# EAGLE design esp_dht (EAGLE 8.1.0)
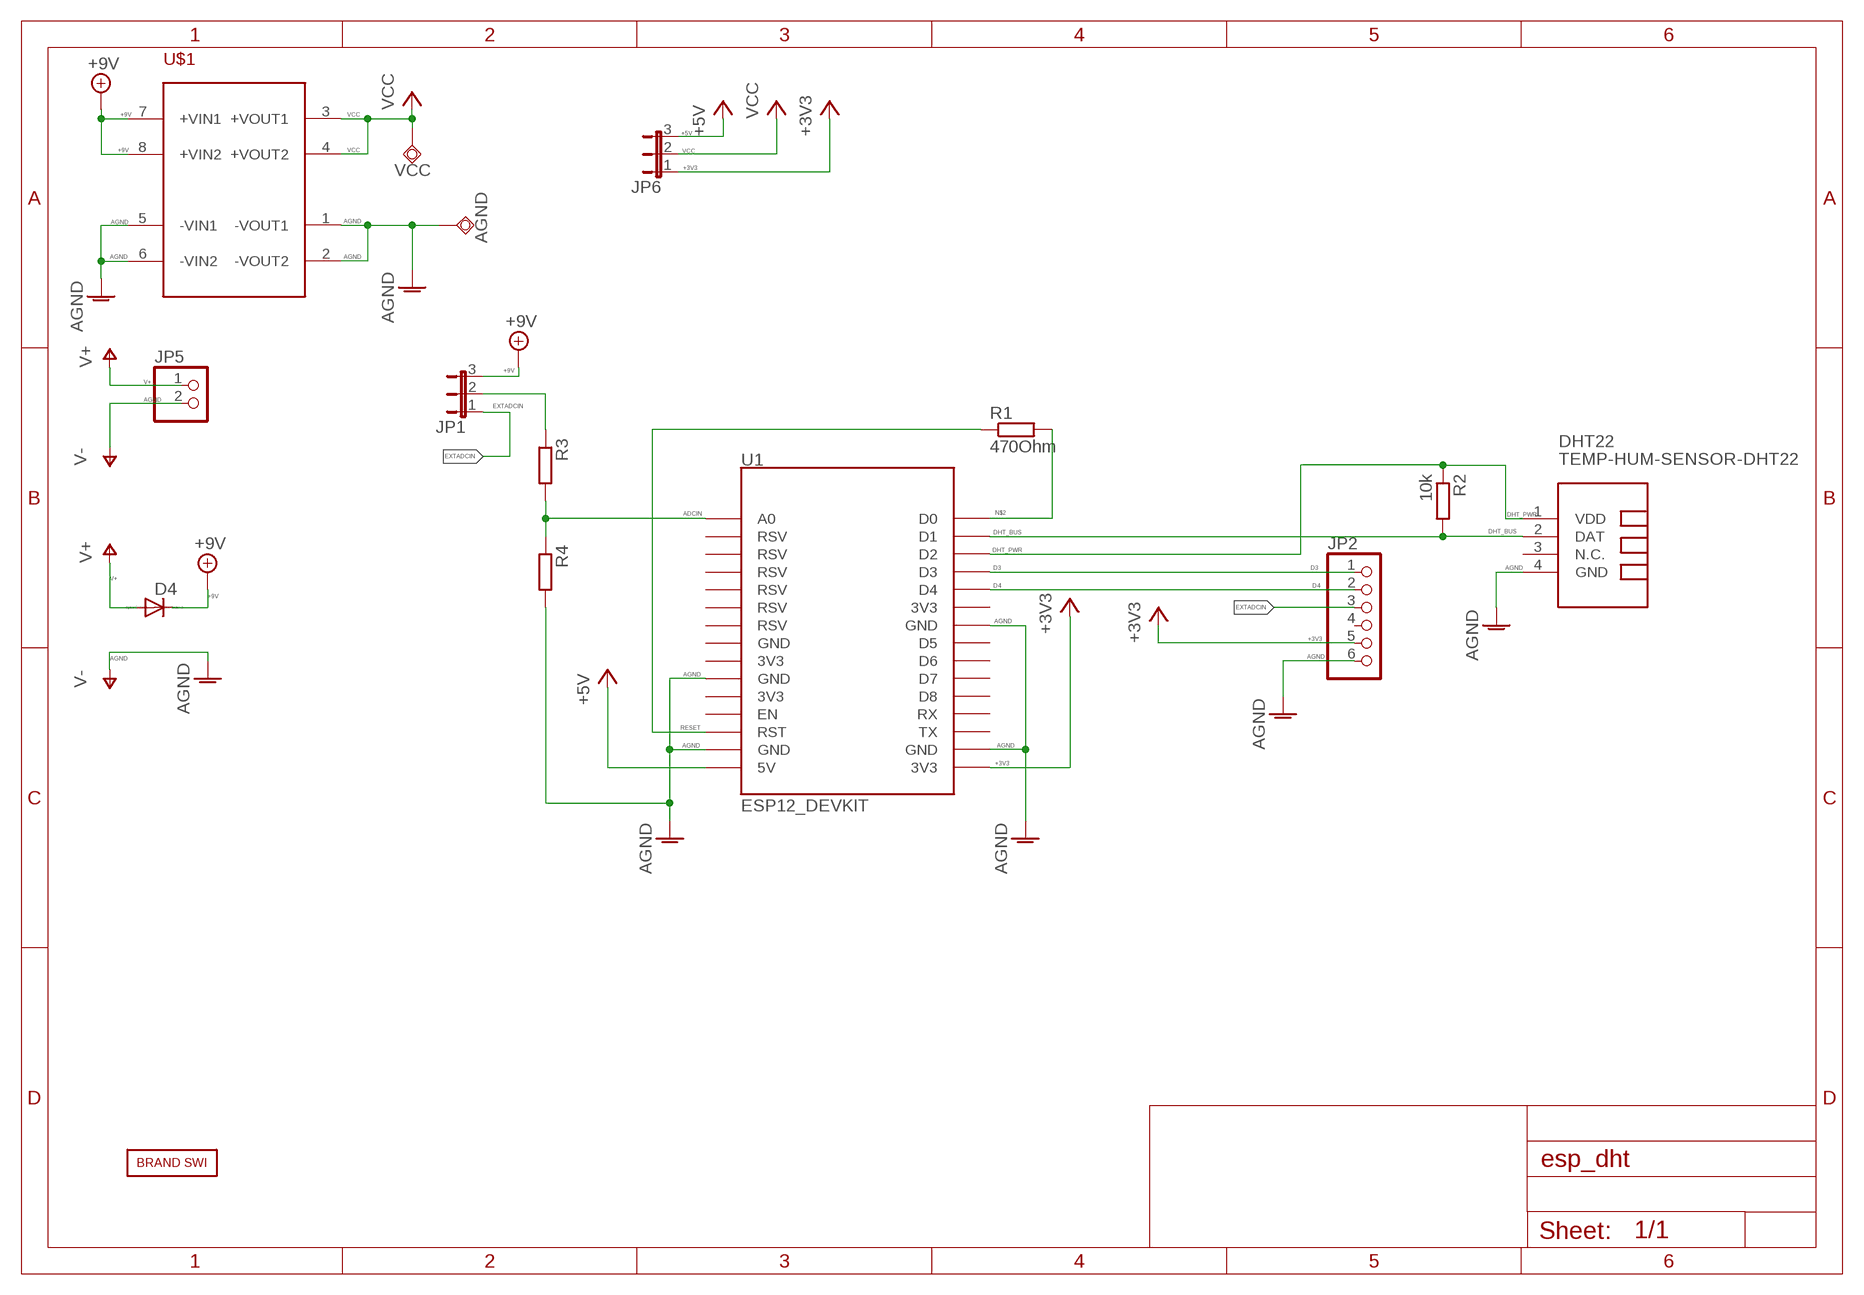
[diagram p0: schematic, sheet 1]

## Parts
AGND  TPSQTP20SQ  [TP20SQ]
D4  1N4148DO35-7  [DO35-7]
DHT22  TEMP-HUM-SENSOR-DHT22  [TEMP-HUM-SENSOR-DHT22]
JP1  JP2E  [JP2]
JP2  PINHD-1X6  [1X06]
JP5  PINHD-1X2  [1X02]
JP6  JP2E  [JP2]
R1  470Ohm  R-EU_R0805  [R0805]
R2  10k  R-EU_R0805  [R0805]
R3  R-EU_R0805  [R0805]
R4  R-EU_R0805  [R0805]
U1  ESP12_DEVKIT  [ESP12_DEVKIT]
U$1  LVPS  [LVPS]
U$2  BRAND_SWI5X7  [BRAND_SWI_5X7]
VCC  TPSQTP20SQ  [TP20SQ]

## Nets
+3V3: JP2.5 JP6.1 U1.3V3@2(3V3)
+5V: JP6.3 U1.5V
+9V: D4.C JP1.3 U$1.7(+VIN1) U$1.8(+VIN2)
ADCIN: R3.2 R4.1 U1.A0
AGND: AGND.TP DHT22.4(GND) JP2.6 JP5.2 R4.2 U1.GND@0(GND) U1.GND@1(GND) U1.GND@2(GND) U1.GND@3(GND) U$1.2(-VOUT2) U$1.5(-VIN1) U$1.6(-VIN2) ; supply symbol labelled V-
D3: JP2.1 U1.D3
D4: JP2.2 U1.D4
DHT_BUS: DHT22.2(DAT) R2.2 U1.D1
DHT_PWR: DHT22.1(VDD) R2.1 U1.D2
EXTADCIN: JP1.1 JP2.3
N$1: JP1.2 R3.1
N$2: R1.2 U1.D0
RESET: R1.1 U1.RST
V+: D4.A JP5.1
VCC: JP6.2 U$1.3(+VOUT1) U$1.4(+VOUT2) VCC.TP
Unconnected: DHT22.3(N.C.) JP2.4 U1.3V3@0(3V3) U1.3V3@1(3V3) U1.3V3@3(3V3) U1.D5 U1.D6 U1.D7 U1.D8 U1.EN U1.GND@4(GND) U1.RSV@0(RSV) U1.RSV@1(RSV) U1.RSV@2(RSV) U1.RSV@3(RSV) U1.RSV@4(RSV) U1.RSV@5(RSV) U1.RX U1.TX U$1.1(-VOUT1)

## Library data of the parts
AGND VCC = testpad:TPSQ: Test pad
D4 = diode:1N4148: DIODE high speed (Philips)
DHT22 = diy-modules:TEMP-HUM-SENSOR-DHT22: DHT22 - digital humidity & temperature sensor Also known as: AM2302 AM2302 datasheet available here: http://akizukidenshi.com/download/ds/aosong/AM2302.pdf Click here to find device on ebay.com <http://www.ebay.com/sch/dht22+digital+sensor>
JP1 JP6 = jumper:JP2E: JUMPER
JP2 = adafruit:PINHD-1X6: PIN HEADER
JP5 = pinhead:PINHD-1X2: PIN HEADER
R1-R4 = rcl:R-EU_: RESISTOR, European symbol
U1 = SWI_COMMONS:ESP12_DEVKIT: ESP12 DEVKIT BOARD
U$1 = SWI_COMMONS:LVPS: Low Voltage Power Supply
U$2 = BRAND_SWI:BRAND_SWI

## Board
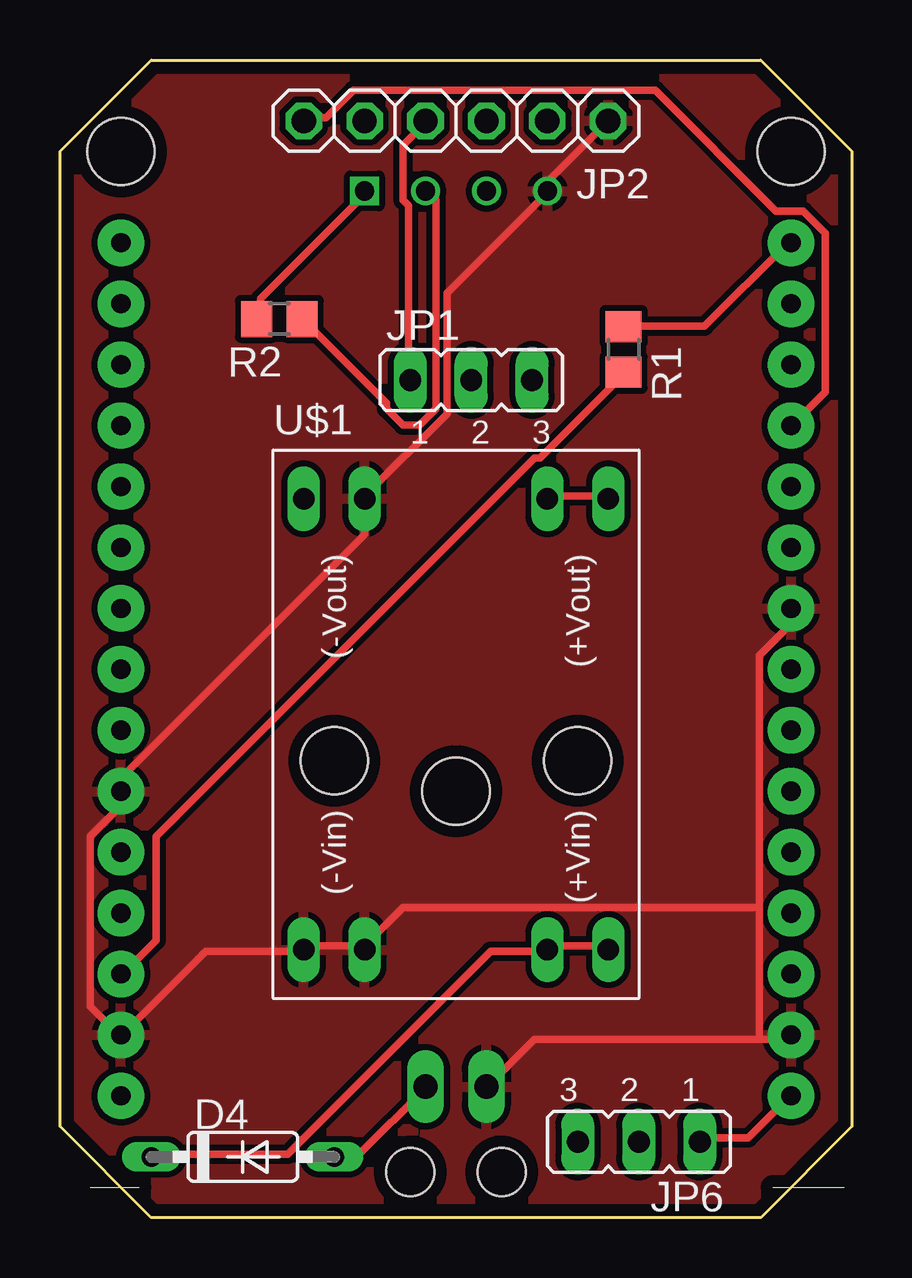
[diagram p1: board, top side]
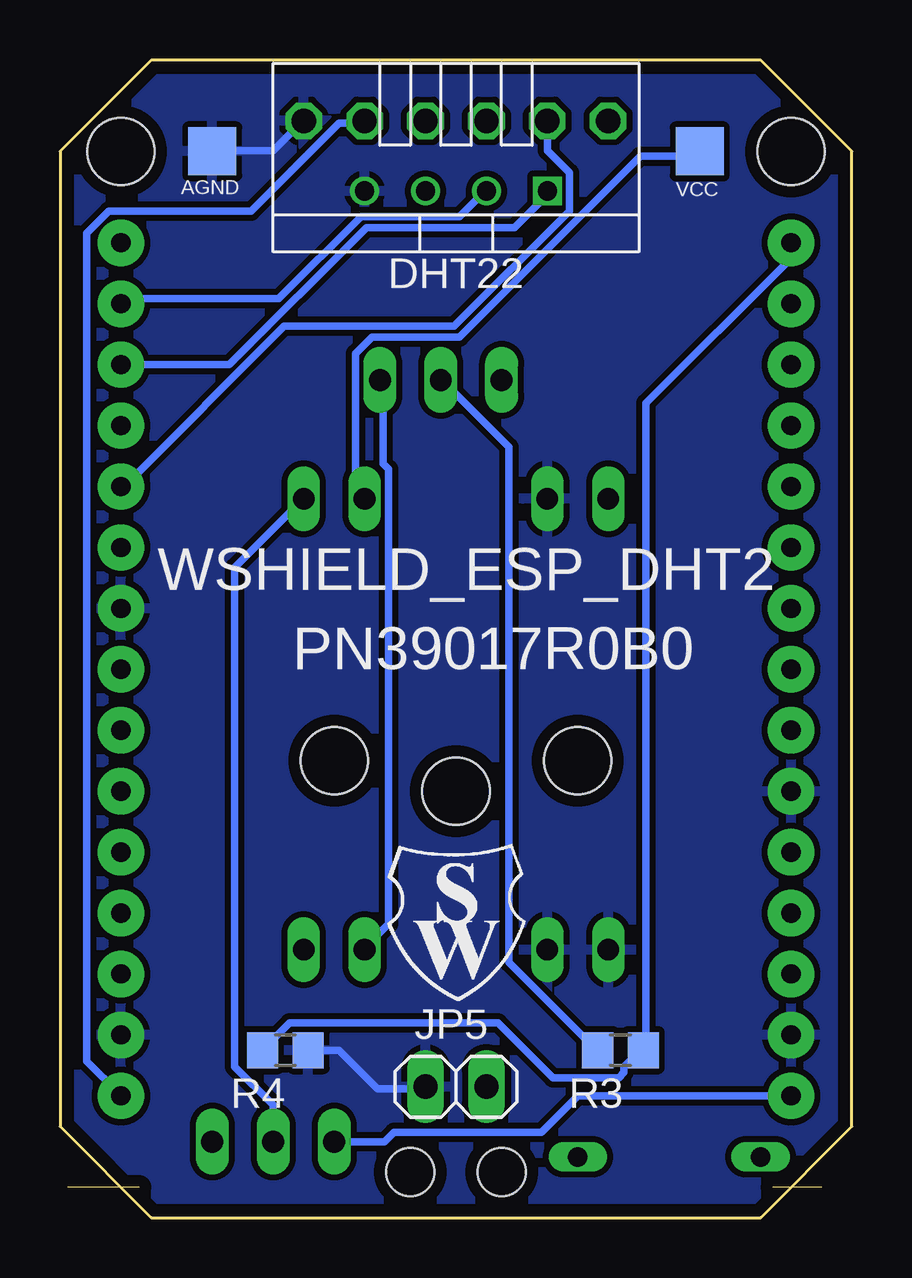
[diagram p2: board, bottom side, seen from below]

Size 33.02 x 48.26 mm. Coordinates in mm from the lower left corner, seen from the top.
Outline: 1.27,1.27 3.3,1.27
Outline: 29.72,1.27 32.69,1.27
Copper layers (1*16): Top 0.035mm / dielectric 1.6mm / Bottom 0.035mm
Design rules "Elecrow_2-layer_PCB_eagle_rule *": minimum track width 12mil, minimum drill 12mil, track to track 6mil, track to pad 6mil, pad to pad 6mil, via to via 8mil, smd to smd 0mil, copper to edge 20mil, drill to drill 10mil, minimum pad ring 6mil, minimum via ring 6mil, stop-mask expansion 0mil, vias tented up to drill 100mil, thermal gap 10mil
Holes 2 mm at 14.61,1.9 18.41,1.9
Holes 2.8 mm at 16.51,17.78 2.54,44.45 30.48,44.45 21.59,19.05 11.43,19.05

### Footprints (pad centres in the part's own frame; a part is rotated, then mirrored left to right if it is on the bottom)
TP20SQ = smd 2 x 2: TP 0,0
DO35-7 = drill 0.813 long: A 3.81,0; C -3.81,0
TEMP-HUM-SENSOR-DHT22 = drill 0.8 square: 1 -3.81,0 | drill 0.8: 2 -1.27,0; 3 1.27,0; 4 3.81,0
JP2 = drill 0.914 long: 1 -2.54,0; 2 0,0; 3 2.54,0
1X06 = drill 1.016 octagon: 1 -6.35,0; 2 -3.81,0; 3 -1.27,0; 4 1.27,0; 5 3.81,0; 6 6.35,0
1X02 = drill 1.016 long: 1 -1.27,0; 2 1.27,0
R0805 = smd 1.3 x 1.5: 1 -0.95,0; 2 0.95,0
ESP12_DEVKIT = drill 0.8 pad 1.93: 3V3@0 -13.97,-7.62; 3V3@1 13.97,5.08; 3V3@2 13.97,-17.78; 3V3@3 -13.97,-2.54; 5V -13.97,-17.78; A0 -13.97,17.78; D0 13.97,17.78; D1 13.97,15.24; D2 13.97,12.7; D3 13.97,10.16; D4 13.97,7.62; D5 13.97,0; D6 13.97,-2.54; D7 13.97,-5.08; D8 13.97,-7.62; EN -13.97,-10.16; GND@0 -13.97,-5.08; GND@1 -13.97,-15.24; GND@2 13.97,2.54; GND@3 13.97,-15.24; GND@4 -13.97,0; RST -13.97,-12.7; RSV@0 -13.97,15.24; RSV@1 -13.97,12.7; RSV@2 -13.97,10.16; RSV@3 -13.97,7.62; RSV@4 -13.97,5.08; RSV@5 -13.97,2.54; RX 13.97,-10.16; TX 13.97,-12.7
LVPS = drill 0.9 long: 1 -6.35,9.4; 2 -3.81,9.4; 3 3.81,9.4; 4 6.35,9.4; 5 -6.35,-9.4; 6 -3.81,-9.4; 7 3.81,-9.4; 8 6.35,-9.4

### Placement (x,y rotation side)
AGND  26.67,44.45 270 bottom
D4  7.62,2.54 0 top
DHT22  16.51,42.8 180 bottom
JP1  17.15,34.92 0 top
JP2  16.51,45.72 0 top
JP5  16.51,5.46 180 bottom
JP6  24.13,3.17 180 top
R1  23.5,36.19 90 top
R2  9.14,37.47 0 top
R3  9.65,6.98 0 bottom
R4  23.62,6.98 0 bottom
U1  16.51,22.86 0 top
U$1  16.51,20.57 0 top
U$2  19.56,8.89 0 bottom
VCC  6.35,44.45 270 bottom

### Tracks (layer width: path | path; a pad name or v marks a point on that pad's centre or on a via)
+3V3
  Top 0.305: JP6.1 26.87,3.33 28.7,3.33 30.3,4.93 U1.3V3@2
  Bottom 0.305: JP2.5 20.47,45.62 21.39,45.62 25.04,41.96 30.99,41.96 31.9,41.05 31.9,6.53 30.53,5.16 U1.3V3@2
+5V
  Bottom 0.305: JP6.3 19.49,3.17 19.1,3.56 12.95,3.56 11.43,5.08 U1.5V
+9V
  Top 0.305: D4.C 4.01,2.64 9.5,2.64 17.96,11.1 20.24,11.1 U$1.7 20.47,11.33 22.76,11.33 U$1.8
  Bottom 0.305: JP1.3 19.56,34.87 19.56,31.45 19.33,31.22 19.33,12.24 20.24,11.33 U$1.7
ADCIN
  Bottom 0.305: R4.1 24.59,6.98 23.44,8.13 14.76,8.13 12.47,5.84 9.73,5.84 9.5,6.07 9.5,6.3 8.81,6.98 R3.2 8.59,6.98 8.59,33.96 2.64,39.9 2.64,40.59 U1.A0
AGND
  Top 0.305: 29.16,7.44 19.79,7.44 17.96,5.61 JP5.2 | 29.16,7.44 30.3,7.44 U1.GND@3 | 29.16,7.44 29.16,12.93 | 29.16,12.93 29.16,23.44 30.3,24.59 30.3,25.27 U1.GND@2 | 12.7,11.33 10.19,11.33 U$1.5 9.96,11.1 6.07,11.1 2.64,7.67 U1.GND@1 2.41,7.67 1.27,8.81 1.27,15.9 2.41,17.04 2.41,17.73 U1.GND@0 2.64,17.96 2.64,18.41 12.7,28.47 U$1.2 12.7,30.07 16.13,33.5 16.13,38.53 20.24,42.65 DHT22.4 20.47,42.88 20.47,43.33 JP2.6 | 29.16,12.93 14.3,12.93 12.7,11.33 | 12.7,11.33 U$1.6
  Bottom 0.305: R4.2 21.39,6.98 19.79,5.38 17.96,5.38 JP5.2 | AGND.TP 26.65,44.47 24.13,44.47 22.99,45.62 JP2.6
  pour Bottom (isolate 0.254): 0,43.18 0,44.45 3.81,48.26 29.21,48.26 33.02,44.45 33.02,3.81 29.21,0 3.81,0 0,3.81
  pour Top (isolate 0.254): 0,43.18 0,44.45 3.81,48.26 29.21,48.26 33.02,44.45 33.02,3.81 29.21,0 3.81,0 0,3.81
D3
  Top 0.305: JP2.1 10.19,45.85 11.1,45.85 12.24,46.99 24.82,46.99 29.84,41.96 30.99,41.96 31.9,41.05 31.9,34.42 30.53,33.05 U1.D3
D4
  Bottom 0.305: JP2.2 12.7,44.47 11.79,43.56 11.79,41.96 16.59,37.16 23.67,37.16 30.3,30.53 U1.D4
DHT_BUS
  Top 0.305: R2.2 10.19,37.39 13.61,33.96 13.61,33.73 14.3,33.05 14.99,33.05 15.67,33.73 15.67,42.42 15.44,42.65 DHT22.2
  Bottom 0.305: U1.D1 30.3,38.3 23.9,38.3 20.47,41.73 16.36,41.73 15.44,42.65 DHT22.2
DHT_PWR
  Top 0.305: R2.1 8.36,37.62 8.36,38.3 12.7,42.65 DHT22.1
  Bottom 0.305: U1.D2 25.96,35.56 20.24,41.28 14.07,41.28 12.7,42.65 DHT22.1
EXTADCIN
  Top 0.305: JP1.1 14.53,35.1 14.53,42.19 14.3,42.42 14.3,44.7 15.22,45.62 JP2.3
N$1
  Bottom 0.305: R3.1 10.64,6.98 14.3,10.64 14.3,32.13 17.04,34.87 JP1.2
N$2
  Top 0.305: R1.2 23.67,37.16 26.87,37.16 30.3,40.59 U1.D0
RESET
  Top 0.305: R1.1 23.44,35.1 20.02,31.67 19.79,31.67 4.01,15.9 4.01,11.56 2.64,10.18 U1.RST
V+
  Top 0.305: D4.A 11.56,2.64 12.47,2.64 15.22,5.38 JP5.1
VCC
  Top 0.305: U$1.4 22.76,30.07 20.47,30.07 U$1.3
  Bottom 0.305: VCC.TP 6.53,44.25 8.81,44.25 16.36,36.7 20.02,36.7 20.7,36.02 20.7,30.3 20.47,30.07 U$1.3 | JP6.2 24.13,4.7 25.73,6.3 25.73,27.1 22.99,29.84 U$1.4

### Text on the board
bNames: WSHIELD_ESP_DHT2 | PN39017R0B0